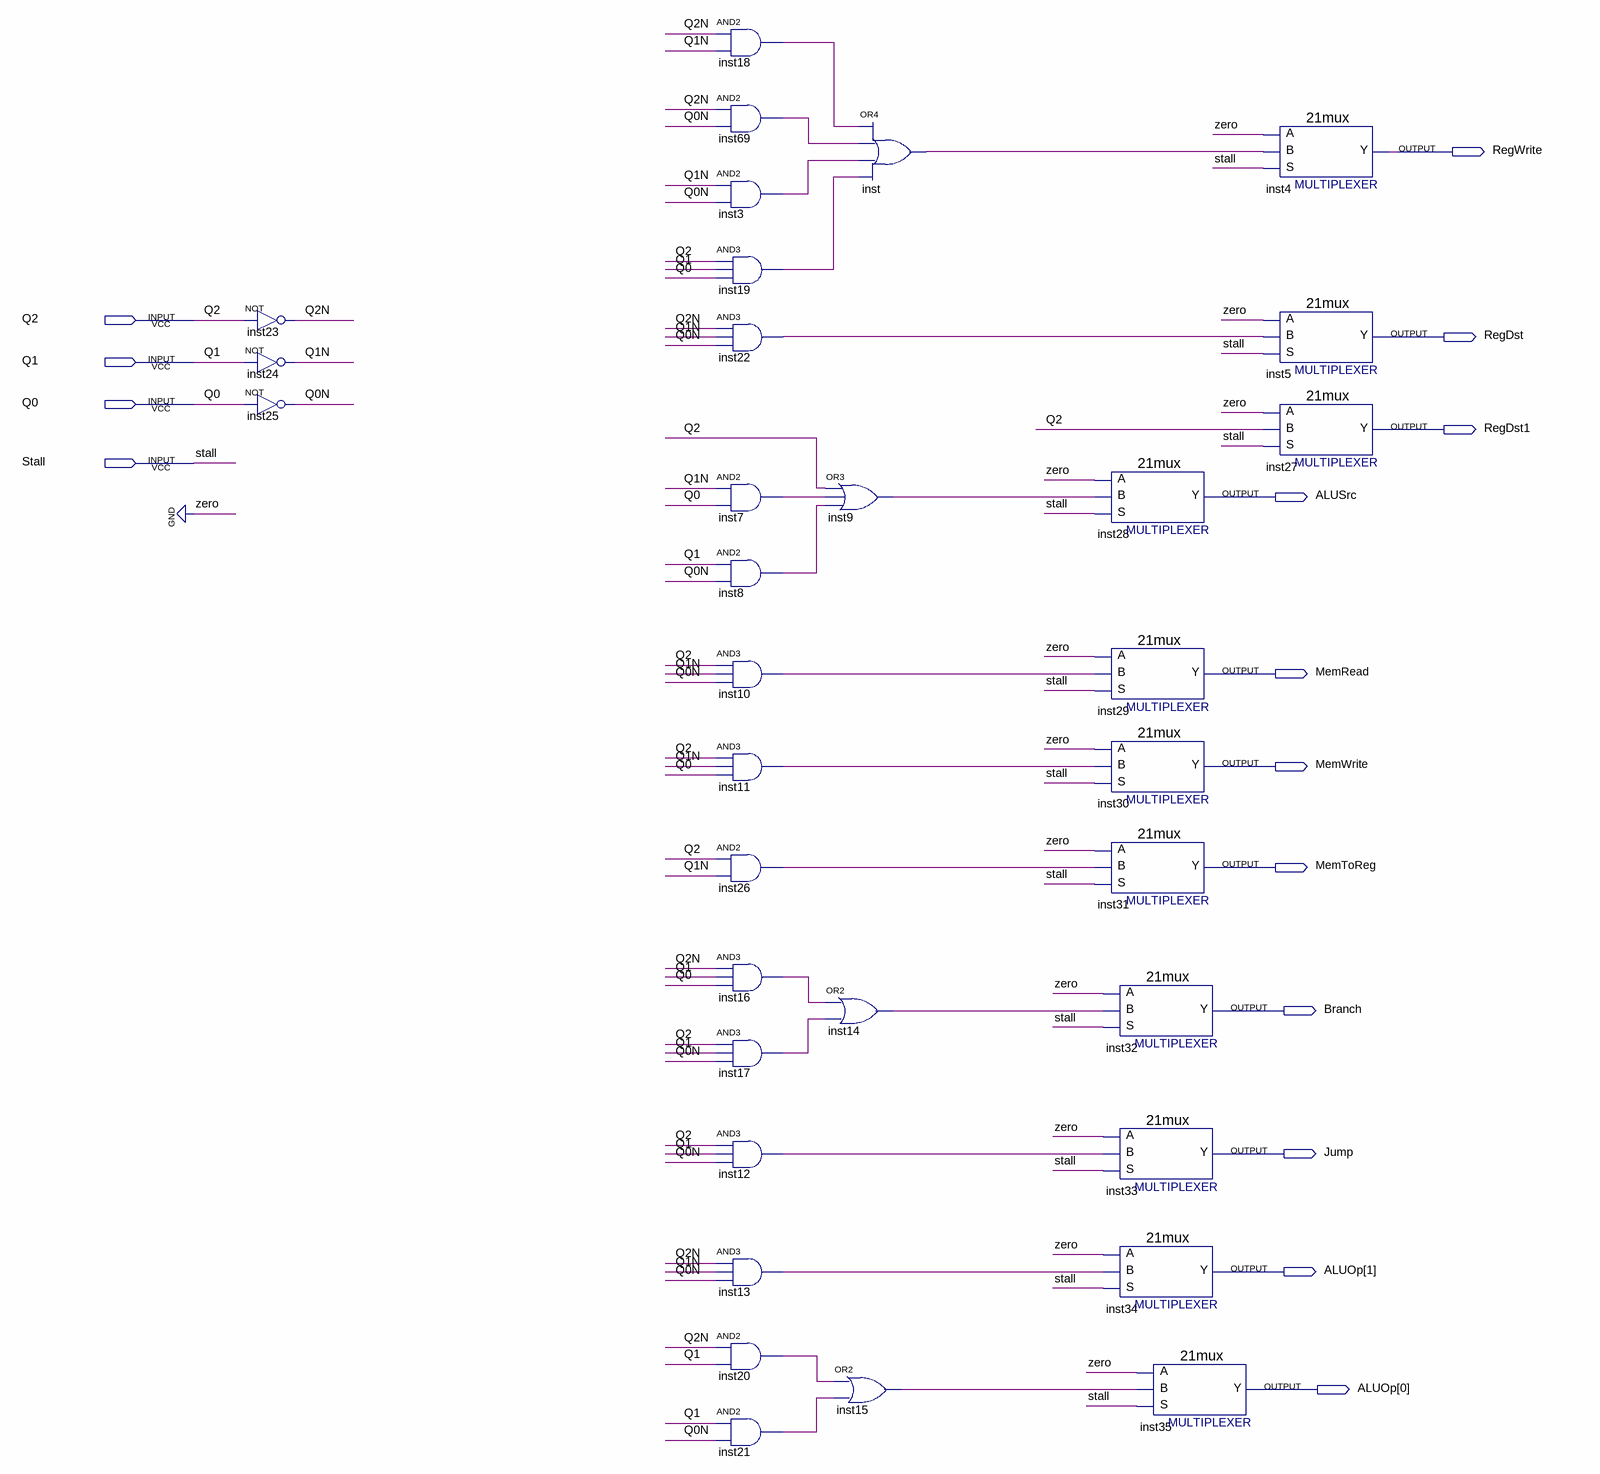
[diagram p0: schematic sheet]
// Quartus schematic ControlUnit.bdf as structural Verilog: 34 symbols, 15 pins
module ControlUnit (
  input  Q2,
  input  Q1,
  input  Q0,
  input  Stall,
  output RegWrite,
  output RegDst,
  output RegDst1,
  output ALUSrc,
  output MemRead,
  output MemWrite,
  output MemToReg,
  output Branch,
  output Jump,
  output [1:0] ALUOp
);

  wire inst3_out, inst7_out, inst8_out, inst9_out, inst10_out, inst11_out, inst12_out, inst13_out,
       inst14_out, inst15_out, inst16_out, inst17_out, inst18_out, inst19_out, inst20_out, inst21_out,
       inst22_out, inst26_out, inst69_out, inst_out, Q0N, Q1N, Q2N;

  not inst23 (Q2N, Q2);
  not inst24 (Q1N, Q1);
  not inst25 (Q0N, Q0);
  and inst18 (inst18_out, Q2N, Q1N);
  and inst69 (inst69_out, Q2N, Q0N);
  and inst3 (inst3_out, Q1N, Q0N);
  and inst19 (inst19_out, Q2, Q1, Q0);
  and inst22 (inst22_out, Q2N, Q1N, Q0N);
  and inst7 (inst7_out, Q1N, Q0);
  and inst8 (inst8_out, Q1, Q0N);
  and inst10 (inst10_out, Q2, Q1N, Q0N);
  and inst11 (inst11_out, Q2, Q1N, Q0);
  and inst26 (inst26_out, Q2, Q1N);
  and inst16 (inst16_out, Q2N, Q1, Q0);
  and inst17 (inst17_out, Q2, Q1, Q0N);
  and inst12 (inst12_out, Q2, Q1, Q0N);
  and inst13 (inst13_out, Q2N, Q1N, Q0N);
  and inst20 (inst20_out, Q2N, Q1);
  and inst21 (inst21_out, Q1, Q0N);
  or inst (inst_out, inst18_out, inst69_out, inst3_out, inst19_out);
  or inst9 (inst9_out, Q2, inst7_out, inst8_out);
  or inst14 (inst14_out, inst16_out, inst17_out);
  or inst15 (inst15_out, inst20_out, inst21_out);
  \21mux  inst28 (.S(Stall), .B(inst9_out), .A(1'b0), .Y(ALUSrc));
  \21mux  inst29 (.S(Stall), .B(inst10_out), .A(1'b0), .Y(MemRead));
  \21mux  inst30 (.S(Stall), .B(inst11_out), .A(1'b0), .Y(MemWrite));
  \21mux  inst31 (.S(Stall), .B(inst26_out), .A(1'b0), .Y(MemToReg));
  \21mux  inst32 (.S(Stall), .B(inst14_out), .A(1'b0), .Y(Branch));
  \21mux  inst33 (.S(Stall), .B(inst12_out), .A(1'b0), .Y(Jump));
  \21mux  inst34 (.S(Stall), .B(inst13_out), .A(1'b0), .Y(ALUOp[1]));
  \21mux  inst35 (.S(Stall), .B(inst15_out), .A(1'b0), .Y(ALUOp[0]));
  \21mux  inst4 (.S(Stall), .B(inst_out), .A(1'b0), .Y(RegWrite));
  \21mux  inst5 (.S(Stall), .B(inst22_out), .A(1'b0), .Y(RegDst));
  \21mux  inst27 (.S(Stall), .B(Q2), .A(1'b0), .Y(RegDst1));
endmodule
